# Altium project RC_Car.PrjPcb
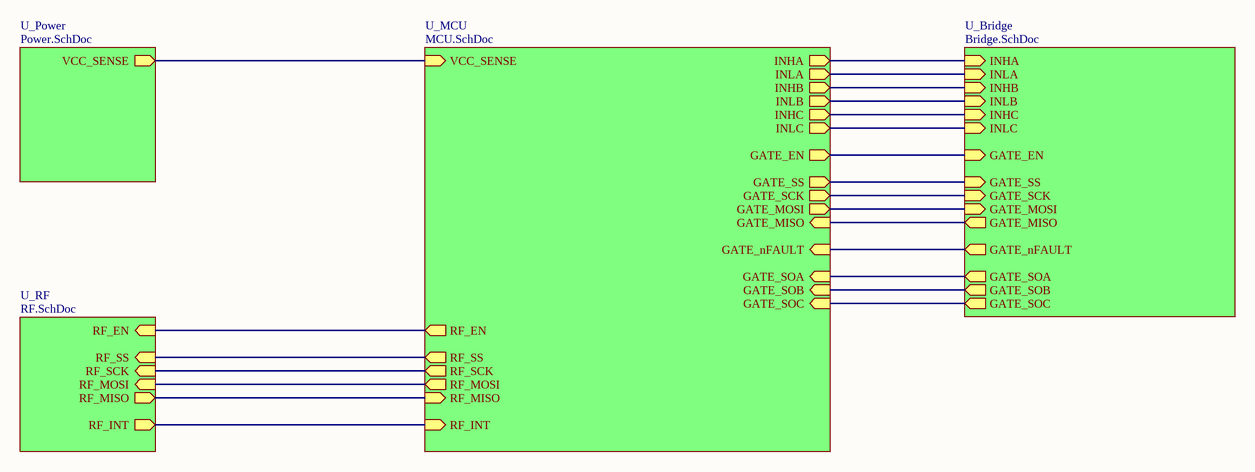
[diagram p0: RC_Car.SchDoc]
7 sheets, 83 parts. Net scope: hierarchical (ports join the sheet entries above them; power ports are global).
Board file: RC_Car_v0.1.PcbDoc
Sheets:
  RC_Car_Block_Diagram.SchDoc
  RC_Car_Power_Diagram.SchDoc
  RC_Car.SchDoc
    U_MCU = MCU.SchDoc
    U_Power = Power.SchDoc
    U_Bridge = Bridge.SchDoc
    U_RF = RF.SchDoc

## Sheet RC_Car_Block_Diagram.SchDoc: Block Diagram
size A4; ApprovedBy: Maduranga Mathara Arachchi; CheckedBy: Maduranga Mathara Arachchi; Author: Maduranga Mathara Arachchi; CompanyName: Maduranga Mathara Arachchi; DrawnBy: Maduranga Mathara Arachchi; Engineer: Maduranga Mathara Arachchi; Organization: Maduranga Mathara Arachchi; Address1: 17/21, Gnanawimala Road,; Address2: Athurugiriya; Address3: Colombo,; Address4: Sri Lanka.; DocumentNumber: 1; Revision: 0.1; SheetNumber: 1; SheetTotal: 7

### Notes on the sheet
- Title
- Size:
- Date:
- A4
- Number:
- Time:
- Revision:
- Sheet
- of
- File:

## Sheet RC_Car_Power_Diagram.SchDoc: Power_Diagram
size A4; ApprovedBy: Maduranga Mathara Arachchi; CheckedBy: Maduranga Mathara Arachchi; Author: Maduranga Mathara Arachchi; CompanyName: Maduranga Mathara Arachchi; DrawnBy: Maduranga Mathara Arachchi; Engineer: Maduranga Mathara Arachchi; Organization: Maduranga Mathara Arachchi; Address1: 17/21, Gnanawimala Road,; Address2: Athurugiriya; Address3: Colombo,; Address4: Sri Lanka.; DocumentNumber: 1; Revision: 0.1; SheetNumber: 2; SheetTotal: 7

### Notes on the sheet
- Title
- Size:
- Date:
- A4
- Number:
- Time:
- Revision:
- Sheet
- of
- File:

## Sheet RC_Car.SchDoc: RC_Car
size A4; ApprovedBy: Maduranga Mathara Arachchi; CheckedBy: Maduranga Mathara Arachchi; Author: Maduranga Mathara Arachchi; CompanyName: Maduranga Mathara Arachchi; DrawnBy: Maduranga Mathara Arachchi; Engineer: Maduranga Mathara Arachchi; Organization: Maduranga Mathara Arachchi; Address1: 17/21, Gnanawimala Road,; Address2: Athurugiriya; Address3: Colombo,; Address4: Sri Lanka.; DocumentNumber: 1; Revision: 0.1; SheetNumber: 3; SheetTotal: 7

### Sub-sheets
U_Bridge = Bridge.SchDoc: GATE_SOA (out), GATE_SOB (out), GATE_SOC (out), GATE_SCK (in), GATE_MOSI (in), GATE_SS (in), GATE_EN (in), INHA (in), INHB (in), INHC (in), INLA (in), INLC (in), INLB (in), GATE_nFAULT (out), GATE_MISO (out)
U_MCU = MCU.SchDoc: VCC_SENSE (in), GATE_SOA (in), GATE_SOB (in), GATE_SOC (in), GATE_SCK (out), GATE_MOSI (out), GATE_SS (out), GATE_EN (out), INHA (out), INHB (out), INHC (out), INLA (out), INLC (out), INLB (out), GATE_nFAULT (in), GATE_MISO (in), RF_EN (out), RF_MOSI (out), RF_SCK (out), RF_SS (out), RF_MISO (in), RF_INT (in)
U_Power = Power.SchDoc: VCC_SENSE (out)
U_RF = RF.SchDoc: RF_EN (in), RF_MOSI (in), RF_SCK (in), RF_SS (in), RF_MISO (out), RF_INT (out)

### Nets
GATE_EN: sheet U_MCU/GATE_EN, sheet U_Bridge/GATE_EN
GATE_MISO: sheet U_MCU/GATE_MISO, sheet U_Bridge/GATE_MISO
GATE_MOSI: sheet U_MCU/GATE_MOSI, sheet U_Bridge/GATE_MOSI
GATE_nFAULT: sheet U_MCU/GATE_nFAULT, sheet U_Bridge/GATE_nFAULT
GATE_SCK: sheet U_MCU/GATE_SCK, sheet U_Bridge/GATE_SCK
GATE_SOA: sheet U_MCU/GATE_SOA, sheet U_Bridge/GATE_SOA
GATE_SOB: sheet U_MCU/GATE_SOB, sheet U_Bridge/GATE_SOB
GATE_SOC: sheet U_MCU/GATE_SOC, sheet U_Bridge/GATE_SOC
GATE_SS: sheet U_MCU/GATE_SS, sheet U_Bridge/GATE_SS
INHA: sheet U_MCU/INHA, sheet U_Bridge/INHA
INHB: sheet U_MCU/INHB, sheet U_Bridge/INHB
INHC: sheet U_MCU/INHC, sheet U_Bridge/INHC
INLA: sheet U_MCU/INLA, sheet U_Bridge/INLA
INLB: sheet U_MCU/INLB, sheet U_Bridge/INLB
INLC: sheet U_MCU/INLC, sheet U_Bridge/INLC
RF_EN: sheet U_MCU/RF_EN, sheet U_RF/RF_EN
RF_INT: sheet U_MCU/RF_INT, sheet U_RF/RF_INT
RF_MISO: sheet U_MCU/RF_MISO, sheet U_RF/RF_MISO
RF_MOSI: sheet U_MCU/RF_MOSI, sheet U_RF/RF_MOSI
RF_SCK: sheet U_MCU/RF_SCK, sheet U_RF/RF_SCK
RF_SS: sheet U_MCU/RF_SS, sheet U_RF/RF_SS
VCC_SENSE: sheet U_MCU/VCC_SENSE, sheet U_Power/VCC_SENSE

### Notes on the sheet
- Title
- Size:
- Date:
- A4
- Number:
- Time:
- Revision:
- Sheet
- of
- File:

## Sheet MCU.SchDoc: MCU
size A4; ApprovedBy: Maduranga Mathara Arachchi; CheckedBy: Maduranga Mathara Arachchi; Author: Maduranga Mathara Arachchi; CompanyName: Maduranga Mathara Arachchi; DrawnBy: Maduranga Mathara Arachchi; Engineer: Maduranga Mathara Arachchi; Organization: Maduranga Mathara Arachchi; Address1: 17/21, Gnanawimala Road,; Address2: Athurugiriya; Address3: Colombo,; Address4: Sri Lanka.; DocumentNumber: 1; Revision: 0.1; SheetNumber: 5; SheetTotal: 7
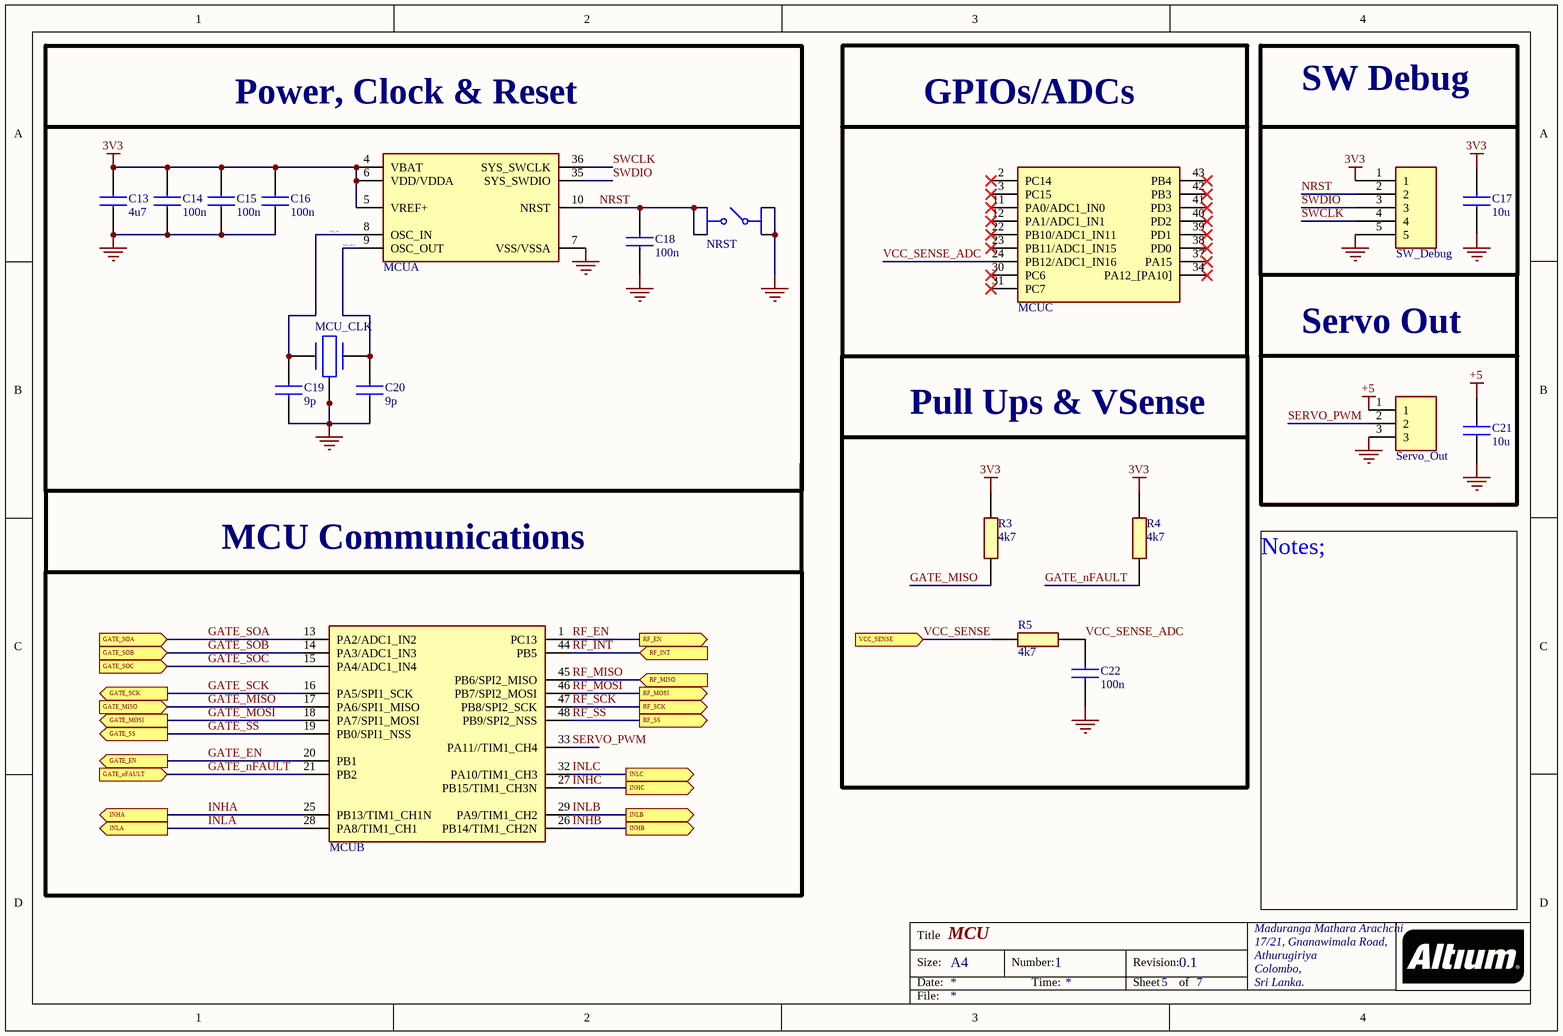
[diagram p1: MCU.SchDoc]

### Parts
C13  4u7  [CAPC1608X90N]
C14  100n  [GRM18x]
C15  100n  [GRM18x]
C16  100n  [GRM18x]
C17  10u  [CAPC1608X90N]
C18  100n  [GRM18x]
C19  9p  [CAPC1005X70N]
C20  9p  [CAPC1005X70N]
C21  10u  [CAPC1608X90N]
C22  100n  [GRM18x]
MCU  STM32G070CBT6TR  [QFP50P900X900X160-48N]  (value not drawn)  (parts A,B,C of 3)
MCU_CLK  TSX-3225_16.0000MF18X-AC0  [TSX3225160000MF18XAC0]  (value not drawn)
NRST  PTS647SM50SMTR2N_LFS  [PTS647SK50SMTR2LFS]  (value not drawn)
R3  4k7  [RESC1608X50N]
R4  4k7  [RESC1608X50N]
R5  4k7  [RESC1608X50N]
Servo_Out  929850-01-03-RA  [RHDR3W76P0X254_1X3_762X254X826P]  (value not drawn)
SW_Debug  SW Debug  [SW_Debug]  (value not drawn)  (no BOM)

### Blocks framed on the sheet
Power, Clock & Reset: C13-C16 C18-C20 MCU MCU_CLK NRST
GPIOs/ADCs: MCU
SW Debug: C17 SW_Debug

### Ports
GATE_EN (out), GATE_MISO (in), GATE_MOSI (out), GATE_nFAULT (in), GATE_SCK (out), GATE_SOA (in), GATE_SOB (in), GATE_SOC (in), GATE_SS (out), INHA (out), INHB (out), INHC (out), INLA (out), INLB (out), INLC (out), RF_EN (out), RF_INT (in), RF_MISO (in), RF_MOSI (out), RF_SCK (out), RF_SS (out), VCC_SENSE (in)

### Nets
3V3: C13.1 C14.2 C15.2 C16.2 C17.2 MCU.4(VBAT) MCU.5(VREF+) MCU.6(VDD/VDDA) R3.2 R4.2 SW_Debug.1
+5: C21.2 Servo_Out.1
GND: C13.2 C14.1 C15.1 C16.1 C17.1 C18.1 C19.1 C20.1 C21.1 C22.1 MCU.7(VSS/VSSA) MCU_CLK.2(GND_1) MCU_CLK.4(GND_2) NRST.3(COM_1) NRST.4(COM_2) Servo_Out.3 SW_Debug.5
GATE_EN: MCU.20(PB1) ; port GATE_EN
GATE_MISO: MCU.17(PA6/SPI1_MISO) R3.1 ; port GATE_MISO
GATE_MOSI: MCU.18(PA7/SPI1_MOSI) ; port GATE_MOSI
GATE_nFAULT: MCU.21(PB2) R4.1 ; port GATE_nFAULT
GATE_SCK: MCU.16(PA5/SPI1_SCK) ; port GATE_SCK
GATE_SOA: MCU.13(PA2/ADC1_IN2) ; port GATE_SOA
GATE_SOB: MCU.14(PA3/ADC1_IN3) ; port GATE_SOB
GATE_SOC: MCU.15(PA4/ADC1_IN4) ; port GATE_SOC
GATE_SS: MCU.19(PB0/SPI1_NSS) ; port GATE_SS
INHA: MCU.25(PB13/TIM1_CH1N) ; port INHA
INHB: MCU.26(PB14/TIM1_CH2N) ; port INHB
INHC: MCU.27(PB15/TIM1_CH3N) ; port INHC
INLA: MCU.28(PA8/TIM1_CH1) ; port INLA
INLB: MCU.29(PA9/TIM1_CH2) ; port INLB
INLC: MCU.32(PA10/TIM1_CH3) ; port INLC
NRST: C18.2 MCU.10(NRST) NRST.1(NO_1) NRST.2(NO_2) SW_Debug.2
OSC_IN: C19.2 MCU.8(OSC_IN) MCU_CLK.1(CRYSTAL_1)
OSC_OUT: C20.2 MCU.9(OSC_OUT) MCU_CLK.3(CRYSTAL_2)
RF_EN: MCU.1(PC13) ; port RF_EN
RF_INT: MCU.44(PB5) ; port RF_INT
RF_MISO: MCU.45(PB6/SPI2_MISO) ; port RF_MISO
RF_MOSI: MCU.46(PB7/SPI2_MOSI) ; port RF_MOSI
RF_SCK: MCU.47(PB8/SPI2_SCK) ; port RF_SCK
RF_SS: MCU.48(PB9/SPI2_NSS) ; port RF_SS
SERVO_PWM: MCU.33(PA11//TIM1_CH4) Servo_Out.2
SWCLK: MCU.36(SYS_SWCLK) SW_Debug.4
SWDIO: MCU.35(SYS_SWDIO) SW_Debug.3
VCC_SENSE: R5.2 ; port VCC_SENSE
VCC_SENSE_ADC: C22.2 MCU.24(PB12/ADC1_IN16) R5.1

Not connected (* = marked no-connect by the designer): MCU 2(PC14)* 3(PC15)* 11(PA0/ADC1_IN0)* 12(PA1/ADC1_IN1)* 22(PB10/ADC1_IN11)* 23(PB11/ADC1_IN15)* 30(PC6)* 31(PC7)* 34(PA12_[PA10])* 37(PA15)* 38(PD0)* 39(PD1)* 40(PD2)* 41(PD3)* 42(PB3)* 43(PB4)*

### Notes on the sheet
- Servo Out
- Pull Ups & VSense
- MCU Communications
- Notes;
- Title
- Size:
- Date:
- A4
- Number:
- Time:
- Revision:
- Sheet
- of
- File:

### Library data of the parts
C13 = GRM188R61E475ME11J: Capacitor; Manufacturer_Name: Murata Electronics; Datasheet Link: https://search.murata.co.jp/Ceramy/image/img/A01X/G101/ENG/GRM188R61E475ME11-01A.pdf; Height: 0.9mm; Manufacturer_Part_Number: GRM188R61E475ME11J; Mouser Part Number: 81-GRM188R61E475ME1J; Mouser Price/Stock: https://www.mouser.co.uk/ProductDetail/Murata-Electronics/GRM188R61E475ME11J?qs=qSfuJ%252Bfl%2Fd5xnSEcMLhPZA%3D%3D; Arrow Part Number: GRM188R61E475ME11J; Arrow Price/Stock: https://www.arrow.com/en/products/grm188r61e475me11j/murata-manufacturing?region=nac
C14-C16 C18 C22 = GRM188R72A104KA35D: Capacitor; Manufacturer_Name: Murata Electronics; Datasheet Link: https://search.murata.co.jp/Ceramy/image/img/A01X/G101/ENG/GRM188R72A104KA35-01A.pdf; Height: 0.9mm; Manufacturer_Part_Number: GRM188R72A104KA35D; Mouser Part Number: 81-GRM188R72A104KA35; Mouser Price/Stock: https://www.mouser.co.uk/ProductDetail/Murata-Electronics/GRM188R72A104KA35D?qs=P%252BBA3F6RM%2F5aaC9LFKRzYw%3D%3D; Arrow Part Number: GRM188R72A104KA35D; Arrow Price/Stock: https://www.arrow.com/en/products/grm188r72a104ka35d/murata-manufacturing?utm_currency=USD&region=nac
C17 C21 = C0603C106M9PAC-TU: Capacitor; Manufacturer_Name: KEMET; Datasheet Link: https://componentsearchengine.com/Datasheets/2/C0603C106M9PAC-TU.pdf; Height: 0.9mm; Manufacturer_Part_Number: C0603C106M9PAC-TU
C19 C20 = GRM1555C1E9R0WA01J: Capacitor; Manufacturer_Name: Murata Electronics; Datasheet Link: http://www.murata.com/~/media/webrenewal/support/library/catalog/products/capacitor/mlcc/c02e.pdf; Height: 0.7mm; Manufacturer_Part_Number: GRM1555C1E9R0WA01J
MCU = STM32G070CBT6TR: Integrated Circuit; Manufacturer_Name: STMicroelectronics; Datasheet Link: https://www.st.com/resource/en/datasheet/stm32g070cb.pdf; Height: 1.6mm; Manufacturer_Part_Number: STM32G070CBT6TR; Mouser Part Number: 511-STM32G070CBT6TR; Mouser Price/Stock: https://www.mouser.co.uk/ProductDetail/STMicroelectronics/STM32G070CBT6TR?qs=xZ%2FP%252Ba9zWqZMnP7ZLxt7Tg%3D%3D; Arrow Part Number: STM32G070CBT6TR; Arrow Price/Stock: https://www.arrow.com/en/products/stm32g070cbt6tr/stmicroelectronics?utm_currency=USD&region=nac
MCU_CLK = TSX-3225_16.0000MF18X-AC0: 16MHz Crystal; Manufacturer_Name: Epson Timing; Manufacturer_Part_Number: TSX-3225 16.0000MF18X-AC0; Datasheet Link: https://www.digikey.ph/en/products/detail/epson/TSX-3225-16-0000MF18X-AC0/5260855; Height: 0.6mm; Mouser Part Number: 732-322516F18XAC0; Mouser Price/Stock: https://www.mouser.co.uk/ProductDetail/Epson-Timing/TSX-3225-16.0000MF18X-AC0?qs=wwacUt%252BV97taurHtFwy%2FEA%3D%3D; Arrow Part Number: TSX-3225 16.0000MF18X-AC0; Arrow Price/Stock: https://www.arrow.com/en/products/tsx-322516.0000mf18x-ac0/epson-electronics-america?utm_currency=USD&region=nac
NRST = PTS647SM50SMTR2N_LFS: Switch (4-Pin Push); Manufacturer_Name: C & K COMPONENTS; Manufacturer_Part_Number: PTS647SM50SMTR2N LFS; Datasheet Link: https://www.ckswitches.com/media/2567/pts647.pdf
R3-R5 = CRCW06034K70FKEC: Resistor; Manufacturer_Name: Vishay; Datasheet Link: http://www.vishay.com/docs/20035/dcrcwe3.pdf; Height: 0.5mm; Manufacturer_Part_Number: CRCW06034K70FKEC; Mouser Part Number: 71-CRCW06034K70FKEC; Mouser Price/Stock: https://www.mouser.co.uk/ProductDetail/Vishay-Dale/CRCW06034K70FKEC?qs=L%252B14cgJd8NPi5InG5zfNWw%3D%3D; Arrow Part Number: CRCW06034K70FKEC; Arrow Price/Stock: https://www.arrow.com/en/products/crcw06034k70fkec/vishay?utm_currency=USD&region=nac
Servo_Out = 929850-01-03-RA: Header; Manufacturer_Name: 3M; Datasheet Link: https://multimedia.3m.com/mws/media/22500O/3mtm-boardmount-skt-100-100x-100strt-sldr-tails-ts0815.pdf; Height: 8.26mm; Manufacturer_Part_Number: 929850-01-03-RA; Mouser Part Number: 517-929850-01-03-RA; Mouser Price/Stock: https://www.mouser.co.uk/ProductDetail/3M-Electronic-Solutions-Division/929850-01-03-RA?qs=neFkstNq%252B6HSkhIqD4w5cg%3D%3D; Arrow Part Number: 929850-01-03-RA; Arrow Price/Stock: https://www.arrow.com/en/products/929850-01-03-ra/3m?region=nac
SW_Debug = Debug Pads

## Sheet Power.SchDoc: Power
size A4; ApprovedBy: Maduranga Mathara Arachchi; CheckedBy: Maduranga Mathara Arachchi; Author: Maduranga Mathara Arachchi; CompanyName: Maduranga Mathara Arachchi; DrawnBy: Maduranga Mathara Arachchi; Engineer: Maduranga Mathara Arachchi; Organization: Maduranga Mathara Arachchi; Address1: 17/21, Gnanawimala Road,; Address2: Athurugiriya; Address3: Colombo,; Address4: Sri Lanka.; DocumentNumber: 1; Revision: 0.1; SheetNumber: 4; SheetTotal: 7
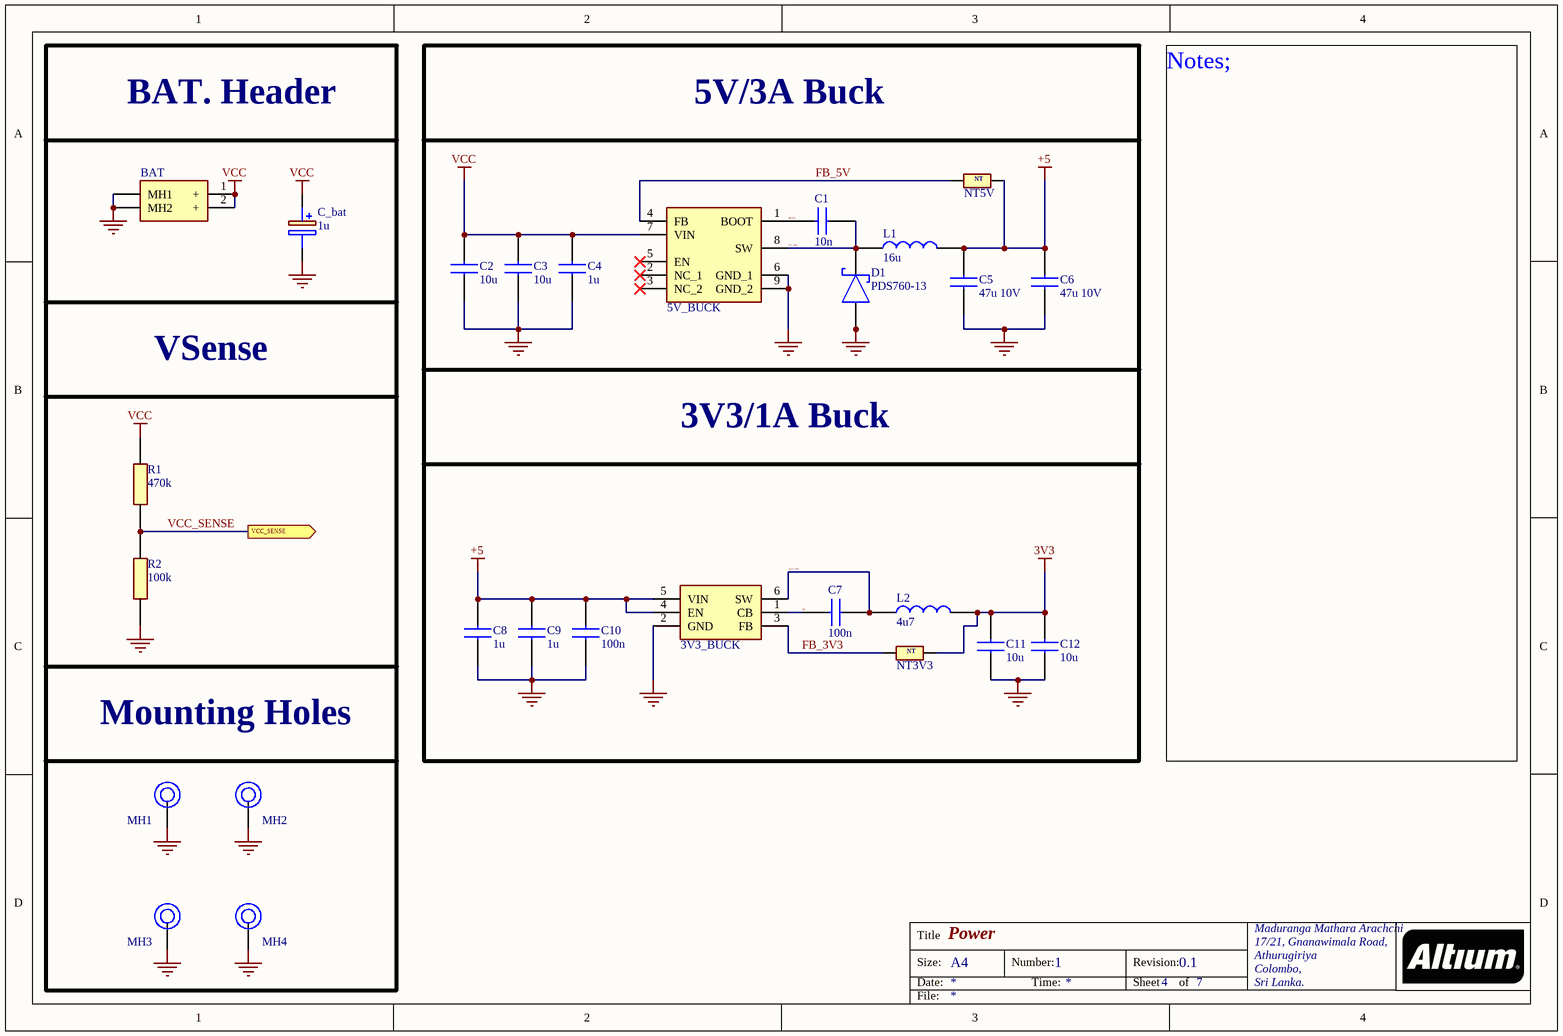
[diagram p2: Power.SchDoc]

### Parts
3V3_BUCK  LMR50410Y3FQDBVRQ1  [SOT95P280X145-6N]  (value not drawn)
5V_BUCK  LM22676QMRX-5.0_NOPB  [SOIC127P600X170-9N]  (value not drawn)
BAT  XT60PW-M  [XT60PWM]  (value not drawn)
C1  10n  [C0603]
C2  10u  [CAPC1608X90N]
C3  10u  [CAPC1608X90N]
C4  1u  [CAPC1608X90N]
C5  47u 10V  [GRM32x]
C6  47u 10V  [GRM32x]
C7  100n  [GRM18x]
C8  1u  [CAPC1608X90N]
C9  1u  [CAPC1608X90N]
C10  100n  [GRM18x]
C11  10u  [CAPC1608X90N]
C12  10u  [CAPC1608X90N]
C_bat  1u  [CAPAE430X550N]
D1  PDS760-13  [PDS76013]
L1  16u  [WE-HCI_105023]
L2  4u7  [SDR0403]
MH1  Mounting Hole 2mm  [Mounting Hole]  (value not drawn)  (no BOM)
MH2  Mounting Hole 2mm  [Mounting Hole]  (value not drawn)  (no BOM)
MH3  Mounting Hole 2mm  [Mounting Hole]  (value not drawn)  (no BOM)
MH4  Mounting Hole 2mm  [Mounting Hole]  (value not drawn)  (no BOM)
NT3V3  NetTie_SMD  [NetTie_SMD]  (value not drawn)  (net tie, no BOM)
NT5V  NetTie_SMD  [NetTie_SMD]  (value not drawn)  (net tie, no BOM)
R1  470k  [ERJP03_PA3_(0603)]
R2  100k  [ERJP03_PA3_(0603)]

### Ports
VCC_SENSE (out)

### Nets
3V3: C11.2 C12.2 L2.2 NT3V3.2
+5: 3V3_BUCK.4(EN) 3V3_BUCK.5(VIN) C5.2 C6.2 C8.2 C9.2 C10.2 L1.2 NT5V.2
GND: 3V3_BUCK.2(GND) 5V_BUCK.6(GND_1) 5V_BUCK.9(GND_2) BAT.MH1 BAT.MH2 C2.1 C3.1 C4.1 C5.1 C6.1 C8.1 C9.1 C10.1 C11.1 C12.1 C_bat.2(-) D1.1(A_1) D1.2(A_2) MH1.1 MH2.1 MH3.1 MH4.1 R2.2
VCC: 5V_BUCK.7(VIN) BAT.1(+) BAT.2(+) C2.2 C3.2 C4.2 C_bat.1(+) R1.1
3V3_SW: 3V3_BUCK.6(SW) C7.2 L2.1
5V_SW: 5V_BUCK.8(SW) C1.2 D1.3(COM_K) L1.1
BOOT: 5V_BUCK.1(BOOT) C1.1
CB: 3V3_BUCK.1(CB) C7.1
FB_3V3: 3V3_BUCK.3(FB) NT3V3.1
FB_5V: 5V_BUCK.4(FB) NT5V.1
VCC_SENSE: R1.2 R2.1 ; port VCC_SENSE

Not connected (* = marked no-connect by the designer): 5V_BUCK 2(NC_1)* 3(NC_2)* 5(EN)*

### Notes on the sheet
- BAT. Header
- 5V/3A Buck
- VSense
- 3V3/1A Buck
- Mounting Holes
- Notes;
- Title
- Size:
- Date:
- A4
- Number:
- Time:
- Revision:
- Sheet
- of
- File:
- (in symbol NetTie_SMD) NT

### Library data of the parts
3V3_BUCK = LMR50410Y3FQDBVRQ1: 3V3 Buck; Manufacturer_Name: Texas Instruments; Datasheet Link: https://www.ti.com/lit/ds/symlink/lmr50410-q1.pdf?ts=1611309677669; Height: 1.45mm; Manufacturer_Part_Number: LMR50410Y3FQDBVRQ1; Mouser Part Number: 595-R50410Y3FQDBVRQ1; Mouser Price/Stock: https://www.mouser.co.uk/ProductDetail/Texas-Instruments/LMR50410Y3FQDBVRQ1?qs=81r%252BiQLm7BTaIXwCgdOuiA%3D%3D; Arrow Part Number: LMR50410Y3FQDBVRQ1; Arrow Price/Stock: https://www.arrow.com/en/products/lmr50410y3fqdbvrq1/texas-instruments?utm_currency=USD&region=europe
5V_BUCK = LM22676QMRX-5.0_NOPB: 5V Buck; Manufacturer_Name: Texas Instruments; Manufacturer_Part_Number: LM22676QMRX-5.0/NOPB; Datasheet Link: https://www.ti.com/general/docs/suppproductinfo.tsp?distId=10&gotoUrl=https%3A%2F%2Fwww.ti.com%2Flit%2Fgpn%2Flm22676; Height: 1.7mm; Mouser Part Number: 926-LM22676QMRX50NPB; Mouser Price/Stock: https://www.mouser.com/Search/Refine.aspx?Keyword=926-LM22676QMRX50NPB
BAT = XT60PW-M: Power Header; Manufacturer_Name: Changzhou Amass Elec; Datasheet Link: https://www.tme.eu/Document/b13629717d44ae038681dba08d18c0b6/XT60PW-M.pdf; Height: 8.4mm; Manufacturer_Part_Number: XT60PW-M
C1 = C0603C103K5RACTU: Capacitor; Manufacturer_Name: KEMET; Datasheet Link: https://content.kemet.com/datasheets/KEM_C1002_X7R_SMD.pdf; Height: 0.87mm; Manufacturer_Part_Number: C0603C103K5RACTU; Mouser Part Number: 80-C0603C103K5R; Mouser Price/Stock: https://www.mouser.co.uk/ProductDetail/KEMET/C0603C103K5RACTU?qs=aZBT8IJKz4hu1X55tMAU6Q%3D%3D; Arrow Part Number: C0603C103K5RACTU; Arrow Price/Stock: https://www.arrow.com/en/products/c0603c103k5ractu/kemet-corporation?utm_currency=USD&region=nac
C2 C3 C11 C12 = C0603C106M9PAC-TU: Capacitor; Manufacturer_Name: KEMET; Datasheet Link: https://componentsearchengine.com/Datasheets/2/C0603C106M9PAC-TU.pdf; Height: 0.9mm; Manufacturer_Part_Number: C0603C106M9PAC-TU
C4 C8 C9 = MSASU168SB5105KTNA01: Capacitor; Manufacturer_Name: TAIYO YUDEN; Datasheet Link: https://ds.yuden.co.jp/TYCOMPAS/or/detail?pn=MSASU168SB5105KTNA01&u=M; Height: 0.9mm; Manufacturer_Part_Number: MSASU168SB5105KTNA01; Mouser Part Number: 963-MSASU168SB5105KT; Mouser Price/Stock: https://www.mouser.co.uk/ProductDetail/TAIYO-YUDEN/MSASU168SB5105KTNA01?qs=tlsG%2FOw5FFjgZgcWjqLW4Q%3D%3D; Arrow Part Number: MSASU168SB5105KTNA01; Arrow Price/Stock: https://www.arrow.com/en/products/msasu168sb5105ktna01/taiyo-yuden?region=nac
C5 C6 = GRM32ER71A476KE15L: Capacitor; Manufacturer_Name: Murata Electronics; Datasheet Link: https://search.murata.co.jp/Ceramy/image/img/A01X/G101/ENG/GRM32ER71A476KE15-04CA.pdf; Height: 1.5mm; Manufacturer_Part_Number: GRM32ER71A476KE15L; Mouser Part Number: 81-GRM32ER71A476KE5L; Mouser Price/Stock: https://www.mouser.co.uk/ProductDetail/Murata-Electronics/GRM32ER71A476KE15L?qs=igOKQWwJTmw3%252BdJ0z0AeYw%3D%3D; Arrow Part Number: GRM32ER71A476KE15L; Arrow Price/Stock: https://www.arrow.com/en/products/grm32er71a476ke15l/murata-manufacturing?utm_currency=USD&region=nac
C7 C10 = GRM188R72A104KA35D: as C14 on sheet MCU; Datasheet Link: https://search.murata.co.jp/Ceramy/image/img/A01X/G101/ENG/GRM188R72A104KA35-01A.pdf; Height: 0.9mm; Manufacturer_Part_Number: GRM188R72A104KA35D; Mouser Part Number: 81-GRM188R72A104KA35; Mouser Price/Stock: https://www.mouser.co.uk/ProductDetail/Murata-Electronics/GRM188R72A104KA35D?qs=P%252BBA3F6RM%2F5aaC9LFKRzYw%3D%3D; Arrow Part Number: GRM188R72A104KA35D; Arrow Price/Stock: https://www.arrow.com/en/products/grm188r72a104ka35d/murata-manufacturing?utm_currency=USD&region=nac
C_bat = 865081740001: Capacitor Polarised; Manufacturer_Name: Wurth Elektronik; Datasheet Link: https://www.we-online.com/components/products/datasheet/865081740001.pdf; Height: 5.5mm; Manufacturer_Part_Number: 865081740001; Mouser Part Number: 710-865081740001; Mouser Price/Stock: https://www.mouser.co.uk/ProductDetail/Wurth-Elektronik/865081740001?qs=amGC7iS6iy8gfpWwzj%2FS%2Fg%3D%3D
D1 = PDS760-13: Schottky Diode; Manufacturer_Name: Diodes Incorporated; Datasheet Link: https://www.diodes.com/assets/Datasheets/PDS760.pdf; Height: 1.15mm; Manufacturer_Part_Number: PDS760-13; Mouser Part Number: 621-PDS760-F; Mouser Price/Stock: https://www.mouser.co.uk/ProductDetail/Diodes-Incorporated/PDS760-13?qs=%2FNF5U5UGuWlxwy7NIrHVWQ%3D%3D; Arrow Part Number: PDS760-13; Arrow Price/Stock: https://www.arrow.com/en/products/pds760-13/diodes-incorporated?region=europe
L1 = 7443251600: Inductor; Manufacturer_Name: Wurth Elektronik; Manufacturer_Part_Number: 7443251600; Mouser Part Number: 710-7443251600; Mouser Price/Stock: https://www.mouser.co.uk/ProductDetail/Wurth-Elektronik/7443251600?qs=VxkwJfKV0FSkbbPOgC7FsA%3D%3D
L2 = SDR0403-4R7ML: Inductor; Manufacturer_Name: Bourns; Datasheet Link: http://www.bourns.com/docs/Product-Datasheets/sdr0403.pdf; Manufacturer_Part_Number: SDR0403-4R7ML; Mouser Part Number: 652-SDR0403-4R7ML; Mouser Price/Stock: https://www.mouser.co.uk/ProductDetail/Bourns/SDR0403-4R7ML?qs=xrpI9KL%2FXvtm2g7dmggyxA%3D%3D; Arrow Part Number: SDR0403-4R7ML; Arrow Price/Stock: https://www.arrow.com/en/products/sdr0403-4r7ml/bourns?region=nac
R1 = ERJ-PA3F4703V: Resistor; Manufacturer_Name: Panasonic; Datasheet Link: https://industrial.panasonic.com/cdbs/www-data/pdf/RDO0000/AOA0000C331.pdf; Height: 0.55mm; Manufacturer_Part_Number: ERJ-PA3F4703V; Mouser Part Number: 667-ERJ-PA3F4703V; Mouser Price/Stock: https://www.mouser.co.uk/ProductDetail/Panasonic/ERJ-PA3F4703V?qs=BzJM0faLVqUgOOiMN4LfmA%3D%3D
R2 = ERJ-PA3F1003V: Resistor; Manufacturer_Name: Panasonic; Datasheet Link: https://industrial.panasonic.com/cdbs/www-data/pdf/RDO0000/AOA0000C331.pdf; Height: 0.55mm; Manufacturer_Part_Number: ERJ-PA3F1003V; Mouser Part Number: 667-ERJ-PA3F1003V; Mouser Price/Stock: https://www.mouser.co.uk/ProductDetail/Panasonic/ERJ-PA3F1003V/?qs=T0XSgvH75d5hvtv%252BnTMv1g%3D%3D

## Sheet Bridge.SchDoc: Bridge
size A4; ApprovedBy: Maduranga Mathara Arachchi; CheckedBy: Maduranga Mathara Arachchi; Author: Maduranga Mathara Arachchi; CompanyName: Maduranga Mathara Arachchi; DrawnBy: Maduranga Mathara Arachchi; Engineer: Maduranga Mathara Arachchi; Organization: Maduranga Mathara Arachchi; Address1: 17/21, Gnanawimala Road,; Address2: Athurugiriya; Address3: Colombo,; Address4: Sri Lanka.; DocumentNumber: 1; Revision: 0.1; SheetNumber: 6; SheetTotal: 7
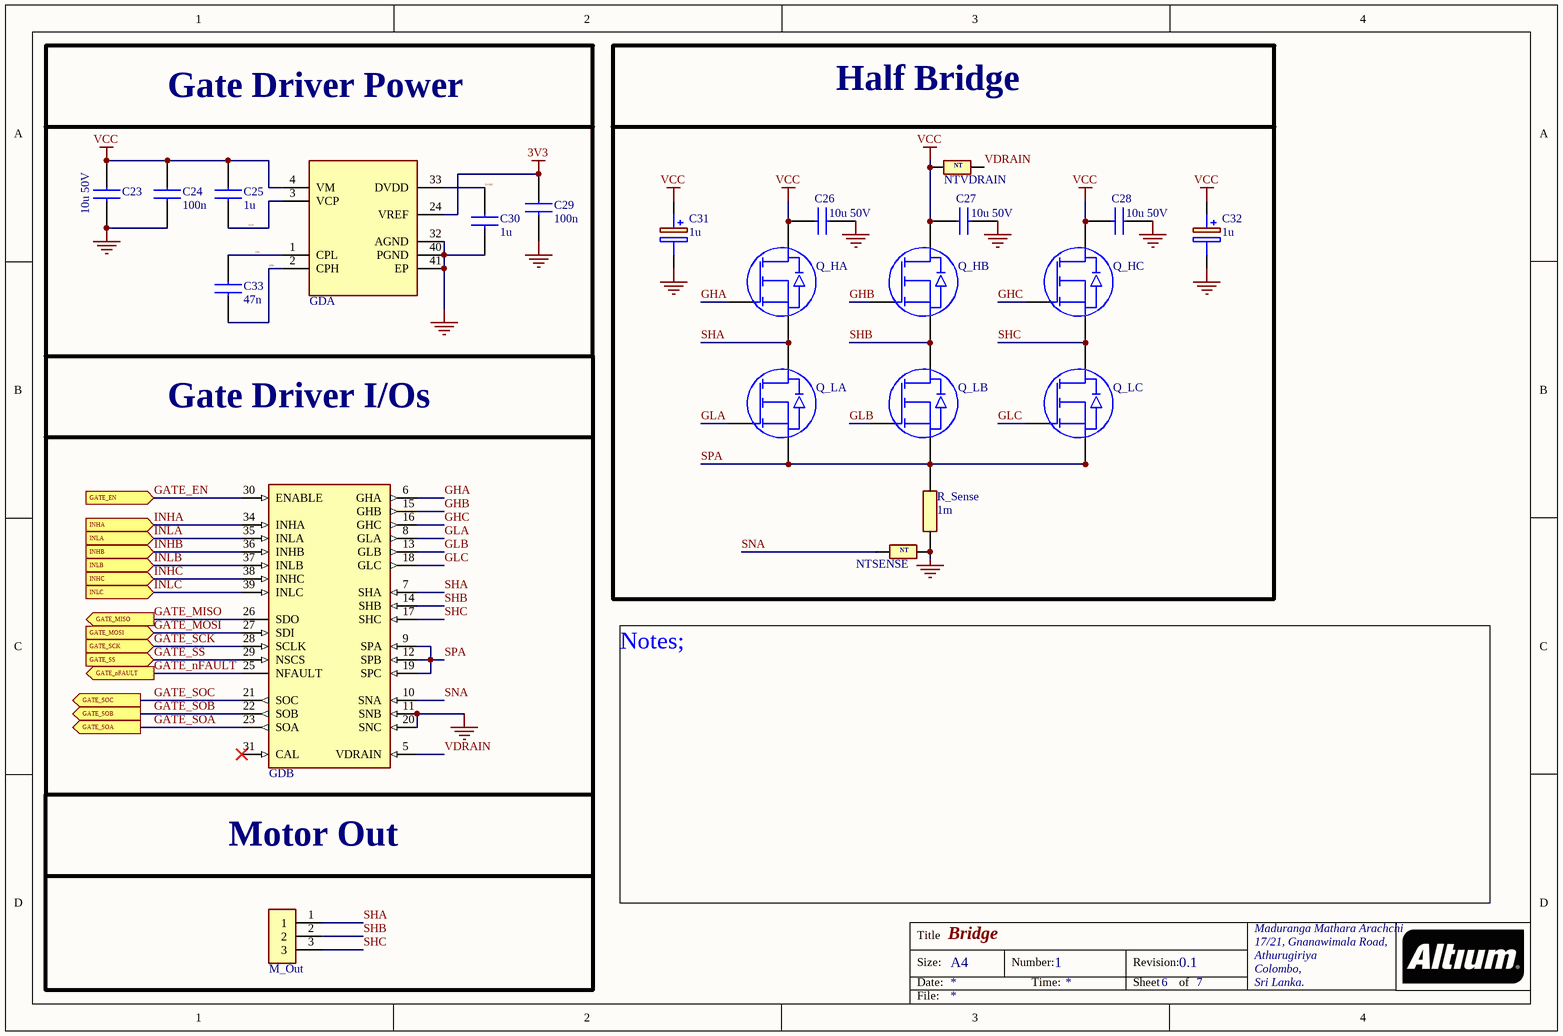
[diagram p3: Bridge.SchDoc]

### Parts
C23  10u 50V  [CAPC1608X90N]
C24  100n  [GRM18x]
C25  1u  [CAPC1608X90N]
C26  10u 50V  [CAPC1608X90N]
C27  10u 50V  [CAPC1608X90N]
C28  10u 50V  [CAPC1608X90N]
C29  100n  [GRM18x]
C30  1u  [CAPC1608X90N]
C31  1u  [CAPAE430X550N]
C32  1u  [CAPAE430X550N]
C33  47n  [CAPC1608X89N]
GD  DRV8323SRTAR  [QFN50P600X600X80-41N-D]  (value not drawn)  (parts A,B of 2)
M_Out  MR60-F.G.Y  [MR60-F.G.Y]  (value not drawn)
NTSENSE  NetTie_SMD  [NetTie_SMD]  (value not drawn)  (net tie, no BOM)
NTVDRAIN  NetTie_SMD  [NetTie_SMD]  (value not drawn)  (net tie, no BOM)
Q_HA  NTMFS5C430NT1G  [NTMFS4C022N]  (value not drawn)
Q_HB  NTMFS5C430NT1G  [NTMFS4C022N]  (value not drawn)
Q_HC  NTMFS5C430NT1G  [NTMFS4C022N]  (value not drawn)
Q_LA  NTMFS5C430NT1G  [NTMFS4C022N]  (value not drawn)
Q_LB  NTMFS5C430NT1G  [NTMFS4C022N]  (value not drawn)
Q_LC  NTMFS5C430NT1G  [NTMFS4C022N]  (value not drawn)
R_Sense  1m  [WSLF12061L000FE6]

### Blocks framed on the sheet
Gate Driver Power: C23-C25 C29 C30 C33 GD
Half Bridge: C26-C28 C31 C32 NTSENSE NTVDRAIN Q_HA Q_HB Q_HC Q_LA Q_LB Q_LC R_Sense

### Ports
GATE_EN (in), GATE_MISO (out), GATE_MOSI (in), GATE_nFAULT (out), GATE_SCK (in), GATE_SOA (out), GATE_SOB (out), GATE_SOC (out), GATE_SS (in), INHA (in), INHB (in), INHC (in), INLA (in), INLB (in), INLC (in)

### Nets
3V3: C29.2 GD.24(VREF)
GND: C23.1 C24.1 C26.2 C27.2 C28.2 C29.1 C30.1 C31.2(-) C32.2(-) GD.11(SNB) GD.20(SNC) GD.32(AGND) GD.40(PGND) GD.41(EP) NTSENSE.2 R_Sense.1
VCC: C23.2 C24.2 C25.2 C26.1 C27.1 C28.1 C31.1(+) C32.1(+) GD.4(VM) NTVDRAIN.1 Q_HA.5(D) Q_HA.6(D) Q_HA.7(D) Q_HA.8(D) Q_HA.9(D) Q_HB.5(D) Q_HB.6(D) Q_HB.7(D) Q_HB.8(D) Q_HB.9(D) Q_HC.5(D) Q_HC.6(D) Q_HC.7(D) Q_HC.8(D) Q_HC.9(D)
CPH: C33.1 GD.2(CPH)
CPL: C33.2 GD.1(CPL)
DVDD: C30.2 GD.33(DVDD)
GATE_EN: GD.30(ENABLE) ; port GATE_EN
GATE_MISO: GD.26(SDO) ; port GATE_MISO
GATE_MOSI: GD.27(SDI) ; port GATE_MOSI
GATE_nFAULT: GD.25(NFAULT) ; port GATE_nFAULT
GATE_SCK: GD.28(SCLK) ; port GATE_SCK
GATE_SOA: GD.23(SOA) ; port GATE_SOA
GATE_SOB: GD.22(SOB) ; port GATE_SOB
GATE_SOC: GD.21(SOC) ; port GATE_SOC
GATE_SS: GD.29(NSCS) ; port GATE_SS
GHA: GD.6(GHA) Q_HA.4(Gate)
GHB: GD.15(GHB) Q_HB.4(Gate)
GHC: GD.16(GHC) Q_HC.4(Gate)
GLA: GD.8(GLA) Q_LA.4(Gate)
GLB: GD.13(GLB) Q_LB.4(Gate)
GLC: GD.18(GLC) Q_LC.4(Gate)
INHA: GD.34(INHA) ; port INHA
INHB: GD.36(INHB) ; port INHB
INHC: GD.38(INHC) ; port INHC
INLA: GD.35(INLA) ; port INLA
INLB: GD.37(INLB) ; port INLB
INLC: GD.39(INLC) ; port INLC
SHA: GD.7(SHA) M_Out.1 Q_HA.1(S) Q_HA.2(S) Q_HA.3(S) Q_LA.5(D) Q_LA.6(D) Q_LA.7(D) Q_LA.8(D) Q_LA.9(D)
SHB: GD.14(SHB) M_Out.2 Q_HB.1(S) Q_HB.2(S) Q_HB.3(S) Q_LB.5(D) Q_LB.6(D) Q_LB.7(D) Q_LB.8(D) Q_LB.9(D)
SHC: GD.17(SHC) M_Out.3 Q_HC.1(S) Q_HC.2(S) Q_HC.3(S) Q_LC.5(D) Q_LC.6(D) Q_LC.7(D) Q_LC.8(D) Q_LC.9(D)
SNA: GD.10(SNA) NTSENSE.1
SPA: GD.9(SPA) GD.12(SPB) GD.19(SPC) Q_LA.1(S) Q_LA.2(S) Q_LA.3(S) Q_LB.1(S) Q_LB.2(S) Q_LB.3(S) Q_LC.1(S) Q_LC.2(S) Q_LC.3(S) R_Sense.2
VCP: C25.1 GD.3(VCP)
VDRAIN: GD.5(VDRAIN) NTVDRAIN.2

Not connected (* = marked no-connect by the designer): GD 31(CAL)*

### Notes on the sheet
- Gate Driver I/Os
- Motor Out
- Notes;
- Title
- Size:
- Date:
- A4
- Number:
- Time:
- Revision:
- Sheet
- of
- File:
- (in symbol NetTie_SMD) NT

### Library data of the parts
C23 C26-C28 = GRM188R61H225KE11D: Capacitor; Manufacturer_Name: Murata Electronics; Datasheet Link: https://search.murata.co.jp/Ceramy/image/img/A01X/G101/ENG/GRM188R61H225KE11-01A.pdf; Height: 0.9mm; Manufacturer_Part_Number: GRM188R61H225KE11D; Mouser Part Number: 81-GRM188R61H225KE1D; Mouser Price/Stock: https://www.mouser.co.uk/ProductDetail/Murata-Electronics/GRM188R61H225KE11D?qs=eeBpzGFlv%252B%2Fz%2FOAJ2DfLOw%3D%3D; Arrow Part Number: GRM188R61H225KE11D; Arrow Price/Stock: https://www.arrow.com/en/products/grm188r61h225ke11d/murata-manufacturing?utm_currency=USD&region=nac
C24 C29 = GRM188R72A104KA35D: as C14 on sheet MCU; Datasheet Link: https://search.murata.co.jp/Ceramy/image/img/A01X/G101/ENG/GRM188R72A104KA35-01A.pdf; Height: 0.9mm; Manufacturer_Part_Number: GRM188R72A104KA35D; Mouser Part Number: 81-GRM188R72A104KA35; Mouser Price/Stock: https://www.mouser.co.uk/ProductDetail/Murata-Electronics/GRM188R72A104KA35D?qs=P%252BBA3F6RM%2F5aaC9LFKRzYw%3D%3D; Arrow Part Number: GRM188R72A104KA35D; Arrow Price/Stock: https://www.arrow.com/en/products/grm188r72a104ka35d/murata-manufacturing?utm_currency=USD&region=nac
C25 C30 = MSASU168SB5105KTNA01: as C4 on sheet Power; Datasheet Link: https://ds.yuden.co.jp/TYCOMPAS/or/detail?pn=MSASU168SB5105KTNA01&u=M; Height: 0.9mm; Manufacturer_Part_Number: MSASU168SB5105KTNA01; Mouser Part Number: 963-MSASU168SB5105KT; Mouser Price/Stock: https://www.mouser.co.uk/ProductDetail/TAIYO-YUDEN/MSASU168SB5105KTNA01?qs=tlsG%2FOw5FFjgZgcWjqLW4Q%3D%3D; Arrow Part Number: MSASU168SB5105KTNA01; Arrow Price/Stock: https://www.arrow.com/en/products/msasu168sb5105ktna01/taiyo-yuden?region=nac
C31 C32 = 865081740001: as C_bat on sheet Power; Datasheet Link: https://www.we-online.com/components/products/datasheet/865081740001.pdf; Height: 5.5mm; Manufacturer_Part_Number: 865081740001; Mouser Part Number: 710-865081740001; Mouser Price/Stock: https://www.mouser.co.uk/ProductDetail/Wurth-Elektronik/865081740001?qs=amGC7iS6iy8gfpWwzj%2FS%2Fg%3D%3D
C33 = KAM15AR71H473KM: Capacitor; Manufacturer_Name: Kyocera AVX; Datasheet Link: https://www.mouser.com/ProductDetail/KYOCERA-AVX/KAM15AR71H473KM?qs=Jm2GQyTW%2Fbirhk%2FTN5CLyw%3D%3D; Height: 0.89mm; Manufacturer_Part_Number: KAM15AR71H473KM; Mouser Part Number: 581-KAM15AR71H473KM; Mouser Price/Stock: https://www.mouser.co.uk/ProductDetail/KYOCERA-AVX/KAM15AR71H473KM?qs=Jm2GQyTW%2Fbirhk%2FTN5CLyw%3D%3D; Arrow Part Number: KAM15AR71H473KM; Arrow Price/Stock: https://www.arrow.com/en/products/kam15ar71h473km/avx?region=nac
GD = DRV8323SRTAR: Integrated Circuit; Manufacturer_Name: Texas Instruments; Datasheet Link: http://www.ti.com/lit/ds/symlink/drv8323.pdf; Height: 0.8mm; Manufacturer_Part_Number: DRV8323SRTAR; Mouser Part Number: 595-DRV8323SRTAR; Mouser Price/Stock: https://www.mouser.co.uk/ProductDetail/Texas-Instruments/DRV8323SRTAR?qs=u4fy%2FsgLU9P2gpPTX6mffg%3D%3D; Arrow Part Number: DRV8323SRTAR; Arrow Price/Stock: https://www.arrow.com/en/products/drv8323srtar/texas-instruments?utm_currency=USD&region=nac
M_Out = MR60-F.G.Y: High Current Pluggable Cables Assemblies ROHS
Q_HA Q_HB Q_HC Q_LA Q_LB Q_LC = NTMFS5C430NT1G: MOSFET (N-Channel); Manufacturer_Name: onsemi; Datasheet Link: https://www.onsemi.com/pub/Collateral/NTMFS4C03N-D.PDF; Height: 1.1mm; Manufacturer_Part_Number: NTMFS5C430NT1G; Mouser Part Number: 863-NTMFS5C430NT1G; Mouser Price/Stock: https://www.mouser.co.uk/ProductDetail/ON-Semiconductor/NTMFS5C430NT1G?qs=OycAS1CGnliPpFX2vF53nQ%3D%3D; Arrow Part Number: NTMFS5C430NT1G; Arrow Price/Stock: https://www.arrow.com/en/products/ntmfs5c430nt1g/on-semiconductor
R_Sense = WSLF12061L000FE6: Resistor; Manufacturer_Name: Vishay; Datasheet Link: https://www.mouser.com/ProductDetail/Vishay-Dale/WSLF12061L000FE6?qs=ZcfC38r4PovQE2MJp0mYbA%3D%3D&srsltid=AfmBOorChnK_yDo1m4XS1OcwHom5geXYRBAQAQW72Pk4TppObIeOkLu6; Height: 1mm; Manufacturer_Part_Number: WSLF12061L000FE6; Mouser Part Number: 71-WSLF12061L000FE6; Mouser Price/Stock: https://www.mouser.co.uk/ProductDetail/Vishay-Dale/WSLF12061L000FE6?qs=ZcfC38r4PovQE2MJp0mYbA%3D%3D

## Sheet RF.SchDoc: RF
size A4; ApprovedBy: Maduranga Mathara Arachchi; CheckedBy: Maduranga Mathara Arachchi; Author: Maduranga Mathara Arachchi; CompanyName: Maduranga Mathara Arachchi; DrawnBy: Maduranga Mathara Arachchi; Engineer: Maduranga Mathara Arachchi; Organization: Maduranga Mathara Arachchi; Address1: 17/21, Gnanawimala Road,; Address2: Athurugiriya; Address3: Colombo,; Address4: Sri Lanka.; DocumentNumber: 1; Revision: 0.1; SheetNumber: 7; SheetTotal: 7
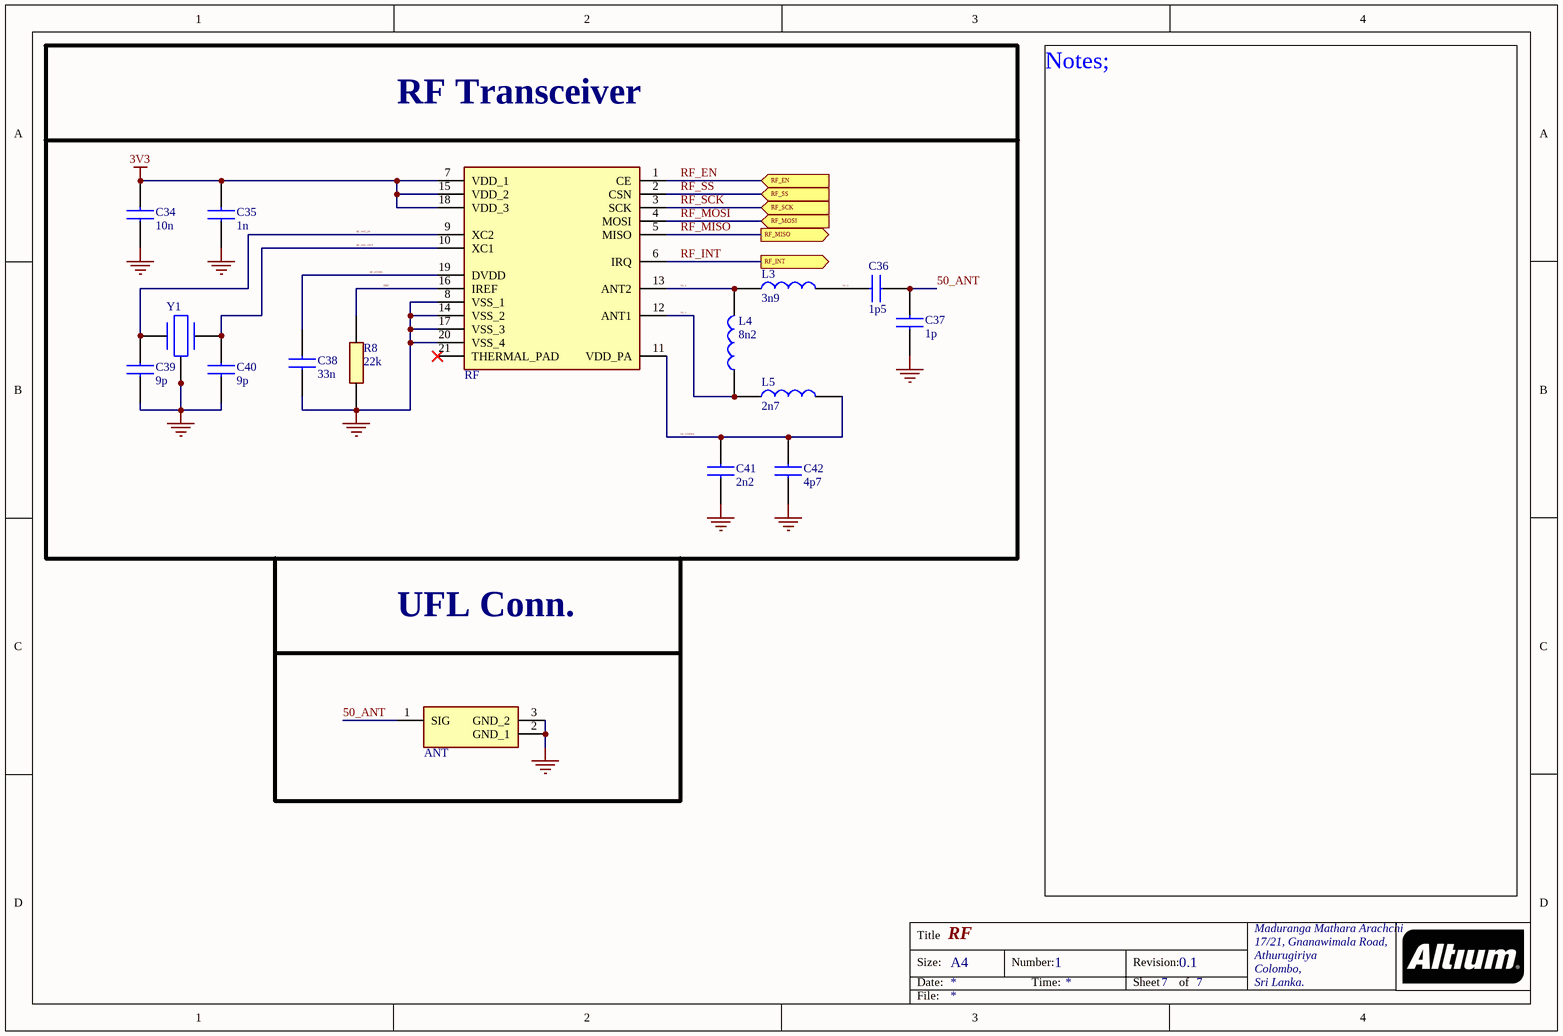
[diagram p4: RF.SchDoc]

### Parts
ANT  CONUFL001-SMD-T  [CONUFL001SMDT]  (value not drawn)
C34  10n  [C0402C104J4RACTU]
C35  1n  [C0402C104J4RACTU]
C36  1p5  [CAPC1005X70N]
C37  1p  [CAPC1005X70N]
C38  33n  [CAPC1005X70N]
C39  9p  [CAPC1005X70N]
C40  9p  [CAPC1005X70N]
C41  2n2  [CAPC1005X56N]
C42  4p7  [CAPC1005X70N]
L3  3n9  [LQW15AN10NG80D]
L4  8n2  [LQG15WH0N7B02D]
L5  2n7  [LQW15CNR20J00B]
R8  22k  [ERJ2RKD1004X]
RF  NRF24L01P-R7  [QFN50P400X400X95-21N-D]  (value not drawn)
Y1  TSX-3225_16.0000MF18X-AC0  [TSX3225160000MF18XAC0]  (value not drawn)

### Blocks framed on the sheet
RF Transceiver: C34-C42 L3-L5 R8 RF Y1

### Ports
RF_EN (in), RF_INT (out), RF_MISO (out), RF_MOSI (in), RF_SCK (in), RF_SS (in)

### Nets
3V3: C34.2 C35.2 RF.7(VDD_1) RF.15(VDD_2) RF.18(VDD_3)
GND: ANT.2(GND_1) ANT.3(GND_2) C34.1 C35.1 C37.1 C38.1 C39.1 C40.1 C41.1 C42.1 R8.1 RF.8(VSS_1) RF.14(VSS_2) RF.17(VSS_3) RF.20(VSS_4) Y1.2(GND_1) Y1.4(GND_2)
50_1: L4.1 L5.1 RF.12(ANT1)
50_2: L3.1 L4.2 RF.13(ANT2)
50_3: C36.1 L3.2
50_ANT: ANT.1(SIG) C36.2 C37.2
50_VDDPA: C41.2 C42.2 L5.2 RF.11(VDD_PA)
IREF: R8.2 RF.16(IREF)
RF_DVDD: C38.2 RF.19(DVDD)
RF_EN: RF.1(CE) ; port RF_EN
RF_INT: RF.6(IRQ) ; port RF_INT
RF_MISO: RF.5(MISO) ; port RF_MISO
RF_MOSI: RF.4(MOSI) ; port RF_MOSI
RF_OSC_IN: C39.2 RF.9(XC2) Y1.1(CRYSTAL_1)
RF_OSC_OUT: C40.2 RF.10(XC1) Y1.3(CRYSTAL_2)
RF_SCK: RF.3(SCK) ; port RF_SCK
RF_SS: RF.2(CSN) ; port RF_SS

Not connected (* = marked no-connect by the designer): RF 21(THERMAL_PAD)*

### Notes on the sheet
- UFL Conn.
- Notes;
- Title
- Size:
- Date:
- A4
- Number:
- Time:
- Revision:
- Sheet
- of
- File:

### Library data of the parts
ANT = CONUFL001-SMD-T: Connector; Manufacturer_Name: TE Connectivity; Datasheet Link: https://eu.mouser.com/datasheet/2/418/9/ENG_DS_CONUFL001_SMD_T_B-3238717.pdf; Height: 1.3mm; Manufacturer_Part_Number: CONUFL001-SMD-T; Mouser Part Number: N/A; Mouser Price/Stock: https://www.mouser.co.uk/ProductDetail/TE-Connectivity/CONUFL001-SMD-T?qs=3Rah4i%252BhyCHmRzMH%252BkLkPQ%3D%3D; Arrow Part Number: CONUFL001-SMD-T; Arrow Price/Stock: https://www.arrow.com/en/products/conufl001-smd-t/te-connectivity?utm_currency=USD&region=europe
C34 = C0402C103K3RECTU: Capacitor; Manufacturer_Name: KEMET; Datasheet Link: https://content.kemet.com/datasheets/KEM_C1002_X7R_SMD.pdf; Height: 0.55mm; Manufacturer_Part_Number: C0402C103K3RECTU
C35 = C0402C102K3RAC: Capacitor; Manufacturer_Name: KEMET; Datasheet Link: https://content.kemet.com/datasheets/KEM_C1002_X7R_SMD.pdf; Height: 0.55mm; Manufacturer_Part_Number: C0402C102K3RAC; Mouser Part Number: 80-C0402C102K3RAC; Mouser Price/Stock: https://www.mouser.co.uk/ProductDetail/KEMET/C0402C102K3RAC?qs=zlI8QACJnq%252BQ2zM2nES6Og%3D%3D; Arrow Part Number: C0402C102K3RAC; Arrow Price/Stock: https://www.arrow.com/en/products/c0402c102k3rac/kemet-corporation
C36 = GRM1555C1E1R5BA01D: Capacitor; Manufacturer_Name: Murata Electronics; Datasheet Link: https://search.murata.co.jp/Ceramy/image/img/A01X/G101/ENG/GRM1555C1E1R5BA01-01A.pdf; Height: 0.7mm; Manufacturer_Part_Number: GRM1555C1E1R5BA01D; Arrow Part Number: GRM1555C1E1R5BA01D; Arrow Price/Stock: https://www.arrow.com/en/products/grm1555c1e1r5ba01d/murata-manufacturing
C37 = GRM1555C1E1R0BA01D: Capacitor; Manufacturer_Name: Murata Electronics; Datasheet Link: https://search.murata.co.jp/Ceramy/image/img/A01X/G101/ENG/GRM1555C1E1R0BA01-01A.pdf; Height: 0.7mm; Manufacturer_Part_Number: GRM1555C1E1R0BA01D; Mouser Part Number: 81-GRM1555C1E1R0BA1D; Mouser Price/Stock: https://www.mouser.com/Search/Refine.aspx?Keyword=81-GRM1555C1E1R0BA1D; Arrow Part Number: GRM1555C1E1R0BA01D; Arrow Price/Stock: https://www.arrow.com/en/products/grm1555c1e1r0ba01d/murata-manufacturing
C38 = GRM155R71E333KA88D: Capacitor; Manufacturer_Name: Murata Electronics; Datasheet Link: https://search.murata.co.jp/Ceramy/image/img/A01X/G101/ENG/GRM155R71E333KA88-01A.pdf; Height: 0.7mm; Manufacturer_Part_Number: GRM155R71E333KA88D; Mouser Part Number: 81-GRM155R71E333KA8D; Mouser Price/Stock: https://www.mouser.com/Search/Refine.aspx?Keyword=81-GRM155R71E333KA8D; Arrow Part Number: GRM155R71E333KA88D; Arrow Price/Stock: https://www.arrow.com/en/products/grm155r71e333ka88d/murata-manufacturing?region=nac
C39 C40 = GRM1555C1E9R0WA01J: as C19 on sheet MCU; Datasheet Link: http://www.murata.com/~/media/webrenewal/support/library/catalog/products/capacitor/mlcc/c02e.pdf; Height: 0.7mm; Manufacturer_Part_Number: GRM1555C1E9R0WA01J
C41 = 04023C222KAT2A: Capacitor; Manufacturer_Name: Kyocera AVX; Datasheet Link: http://www.mouser.com/catalog/supplier/library/pdf/AVXSurfaceMountCeramic.pdf; Height: 0.56mm; Manufacturer_Part_Number: 04023C222KAT2A; Mouser Part Number: 581-04023C222KAT2A; Mouser Price/Stock: https://www.mouser.co.uk/ProductDetail/KYOCERA-AVX/04023C222KAT2A?qs=KeJ6wBBJrrorroMRPCeIVQ%3D%3D; Arrow Part Number: 04023C222KAT2A; Arrow Price/Stock: https://www.arrow.com/en/products/04023c222kat2a/avx?utm_currency=USD&region=nac
C42 = GRM1555C1E4R7BA01D: Capacitor; Manufacturer_Name: Murata Electronics; Datasheet Link: https://search.murata.co.jp/Ceramy/image/img/A01X/G101/ENG/GRM1555C1E4R7BA01-01A.pdf; Height: 0.7mm; Manufacturer_Part_Number: GRM1555C1E4R7BA01D; Mouser Part Number: 81-GRM1555C1E4R7BA1D; Mouser Price/Stock: https://www.mouser.co.uk/ProductDetail/Murata-Electronics/GRM1555C1E4R7BA01D?qs=ouTquLLW2S4mxqzIU81JVw%3D%3D; Arrow Part Number: GRM1555C1E4R7BA01D; Arrow Price/Stock: https://www.arrow.com/en/products/grm1555c1e4r7ba01d/murata-manufacturing?region=nac
L3 = LQW15AN3N9G80D: Inductor; Manufacturer_Name: Murata Electronics; Datasheet Link: https://search.murata.co.jp/Ceramy/image/img/P02/JELF243A-0100.pdf; Height: 0.6mm; Manufacturer_Part_Number: LQW15AN3N9G80D; Mouser Part Number: 81-LQW15AN3N9G80D; Mouser Price/Stock: https://www.mouser.co.uk/ProductDetail/Murata-Electronics/LQW15AN3N9G80D?qs=QzBtWTOodeVJ47BgUNTlYA%3D%3D
L4 = LQG15HS8N2G02D: Inductor; Manufacturer_Name: Murata Electronics; Datasheet Link: https://search.murata.co.jp/Ceramy/image/img/P02/JELF243B-0010.pdf; Height: 0.6mm; Manufacturer_Part_Number: LQG15HS8N2G02D; Mouser Part Number: 81-LQG15HS8N2G02D; Mouser Price/Stock: https://www.mouser.co.uk/ProductDetail/Murata-Electronics/LQG15HS8N2G02D?qs=d0WKAl%252BL4KapDveqKJ4FDA%3D%3D
L5 = LQW15AN2N7G8ZD: Inductor; Manufacturer_Name: Murata Electronics; Datasheet Link: https://search.murata.co.jp/Ceramy/image/img/P02/JELF243A-9138.pdf; Height: 0.6mm; Manufacturer_Part_Number: LQW15AN2N7G8ZD; Mouser Part Number: 81-LQW15AN2N7G8ZD; Mouser Price/Stock: https://www.mouser.com/Search/Refine.aspx?Keyword=81-LQW15AN2N7G8ZD
R8 = ERJ-2RKF2202X: Resistor; Manufacturer_Name: Panasonic; Datasheet Link: https://industrial.panasonic.com/cdbs/www-data/pdf/RDA0000/AOA0000C86.pdf; Height: 0.4mm; Manufacturer_Part_Number: ERJ-2RKF2202X; Mouser Part Number: 667-ERJ-2RKF2202X; Mouser Price/Stock: https://www.mouser.co.uk/ProductDetail/Panasonic/ERJ-2RKF2202X?qs=YMBIwoNQYdW1VNg8fYH1Ug%3D%3D; Arrow Part Number: ERJ-2RKF2202X; Arrow Price/Stock: https://www.arrow.com/en/products/erj-2rkf2202x/panasonic?region=europe
RF = NRF24L01P-R7: Integrated Circuit; Manufacturer_Name: Nordic Semiconductor; Datasheet Link: https://www.mouser.com/ds/2/297/nRF24L01P-1187709.pdf; Height: 0.95mm; Manufacturer_Part_Number: NRF24L01P-R7; Mouser Part Number: 949-NRF24L01P-R7; Mouser Price/Stock: https://www.mouser.co.uk/ProductDetail/Nordic-Semiconductor/nRF24L01P-R7?qs=yd0qOhnSiDe8zMRXiZkGiQ%3D%3D; Arrow Part Number: NRF24L01P-R7; Arrow Price/Stock: https://www.arrow.com/en/products/nrf24l01p-r7/nordic-semiconductor?utm_currency=USD&region=nac
Y1 = TSX-3225_16.0000MF18X-AC0: as MCU_CLK on sheet MCU; Datasheet Link: https://www.digikey.ph/en/products/detail/epson/TSX-3225-16-0000MF18X-AC0/5260855; Height: 0.6mm; Mouser Part Number: 732-322516F18XAC0; Mouser Price/Stock: https://www.mouser.co.uk/ProductDetail/Epson-Timing/TSX-3225-16.0000MF18X-AC0?qs=wwacUt%252BV97taurHtFwy%2FEA%3D%3D; Arrow Part Number: TSX-3225 16.0000MF18X-AC0; Arrow Price/Stock: https://www.arrow.com/en/products/tsx-322516.0000mf18x-ac0/epson-electronics-america?utm_currency=USD&region=nac

## Nets that join several sheets
3V3: MCU (11 pins), Power (C11.2 C12.2 L2.2 NT3V3.2), Bridge (C29.2 GD.24), RF (5 pins)
+5: MCU (C21.2 Servo_Out.1), Power (9 pins)
GND: MCU (17 pins), Power (23 pins), Bridge (16 pins), RF (17 pins)
VCC: Power (8 pins), Bridge (25 pins)
GATE_EN: MCU (MCU.20), Bridge (GD.30)
GATE_MISO: MCU (MCU.17 R3.1), Bridge (GD.26)
GATE_MOSI: MCU (MCU.18), Bridge (GD.27)
GATE_nFAULT: MCU (MCU.21 R4.1), Bridge (GD.25)
GATE_SCK: MCU (MCU.16), Bridge (GD.28)
GATE_SOA: MCU (MCU.13), Bridge (GD.23)
GATE_SOB: MCU (MCU.14), Bridge (GD.22)
GATE_SOC: MCU (MCU.15), Bridge (GD.21)
GATE_SS: MCU (MCU.19), Bridge (GD.29)
INHA: MCU (MCU.25), Bridge (GD.34)
INHB: MCU (MCU.26), Bridge (GD.36)
INHC: MCU (MCU.27), Bridge (GD.38)
INLA: MCU (MCU.28), Bridge (GD.35)
INLB: MCU (MCU.29), Bridge (GD.37)
INLC: MCU (MCU.32), Bridge (GD.39)
RF_EN: MCU (MCU.1), RF (RF.1)
RF_INT: MCU (MCU.44), RF (RF.6)
RF_MISO: MCU (MCU.45), RF (RF.5)
RF_MOSI: MCU (MCU.46), RF (RF.4)
RF_SCK: MCU (MCU.47), RF (RF.3)
RF_SS: MCU (MCU.48), RF (RF.2)
VCC_SENSE: MCU (R5.2), Power (R1.2 R2.1)